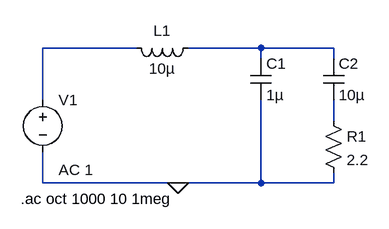
[diagram p0: schematic spice_filter_simulation.asc]
spice_filter_simulation.asc, the LTspice schematic file:
Version 4
SHEET 1 880 680
WIRE 32 128 -112 128
WIRE 224 128 112 128
WIRE 336 128 224 128
WIRE 224 144 224 128
WIRE 336 144 336 128
WIRE -112 208 -112 128
WIRE 336 240 336 208
WIRE -112 336 -112 288
WIRE 96 336 -112 336
WIRE 224 336 224 208
WIRE 224 336 96 336
WIRE 336 336 336 320
WIRE 336 336 224 336
FLAG 96 336 0
SYMBOL ind 128 112 R90
WINDOW 0 5 56 VBottom 2
WINDOW 3 32 56 VTop 2
SYMATTR InstName L1
SYMATTR Value 10µ
SYMATTR SpiceLine Rser=20m
SYMBOL cap 208 144 R0
SYMATTR InstName C1
SYMATTR Value 1µ
SYMBOL cap 320 144 R0
SYMATTR InstName C2
SYMATTR Value 10µ
SYMBOL res 320 224 R0
SYMATTR InstName R1
SYMATTR Value 2.2
SYMBOL voltage -112 192 R0
WINDOW 123 24 124 Left 2
WINDOW 39 0 0 Left 0
SYMATTR InstName V1
SYMATTR Value ""
SYMATTR Value2 AC 1
TEXT -146 360 Left 2 !.ac oct 1000 10 1meg

The netlist it stands for:
* spice_filter_simulation.asc
L1 N002 N001 10µ Rser=20m
C1 N002 0 1µ
C2 N002 N003 10µ
R1 N003 0 2.2
V1 N001 0 AC 1
.ac oct 1000 10 1meg
.backanno
.end